# EAGLE design GasSensorModule_v2.2 (EAGLE 7.4.0)
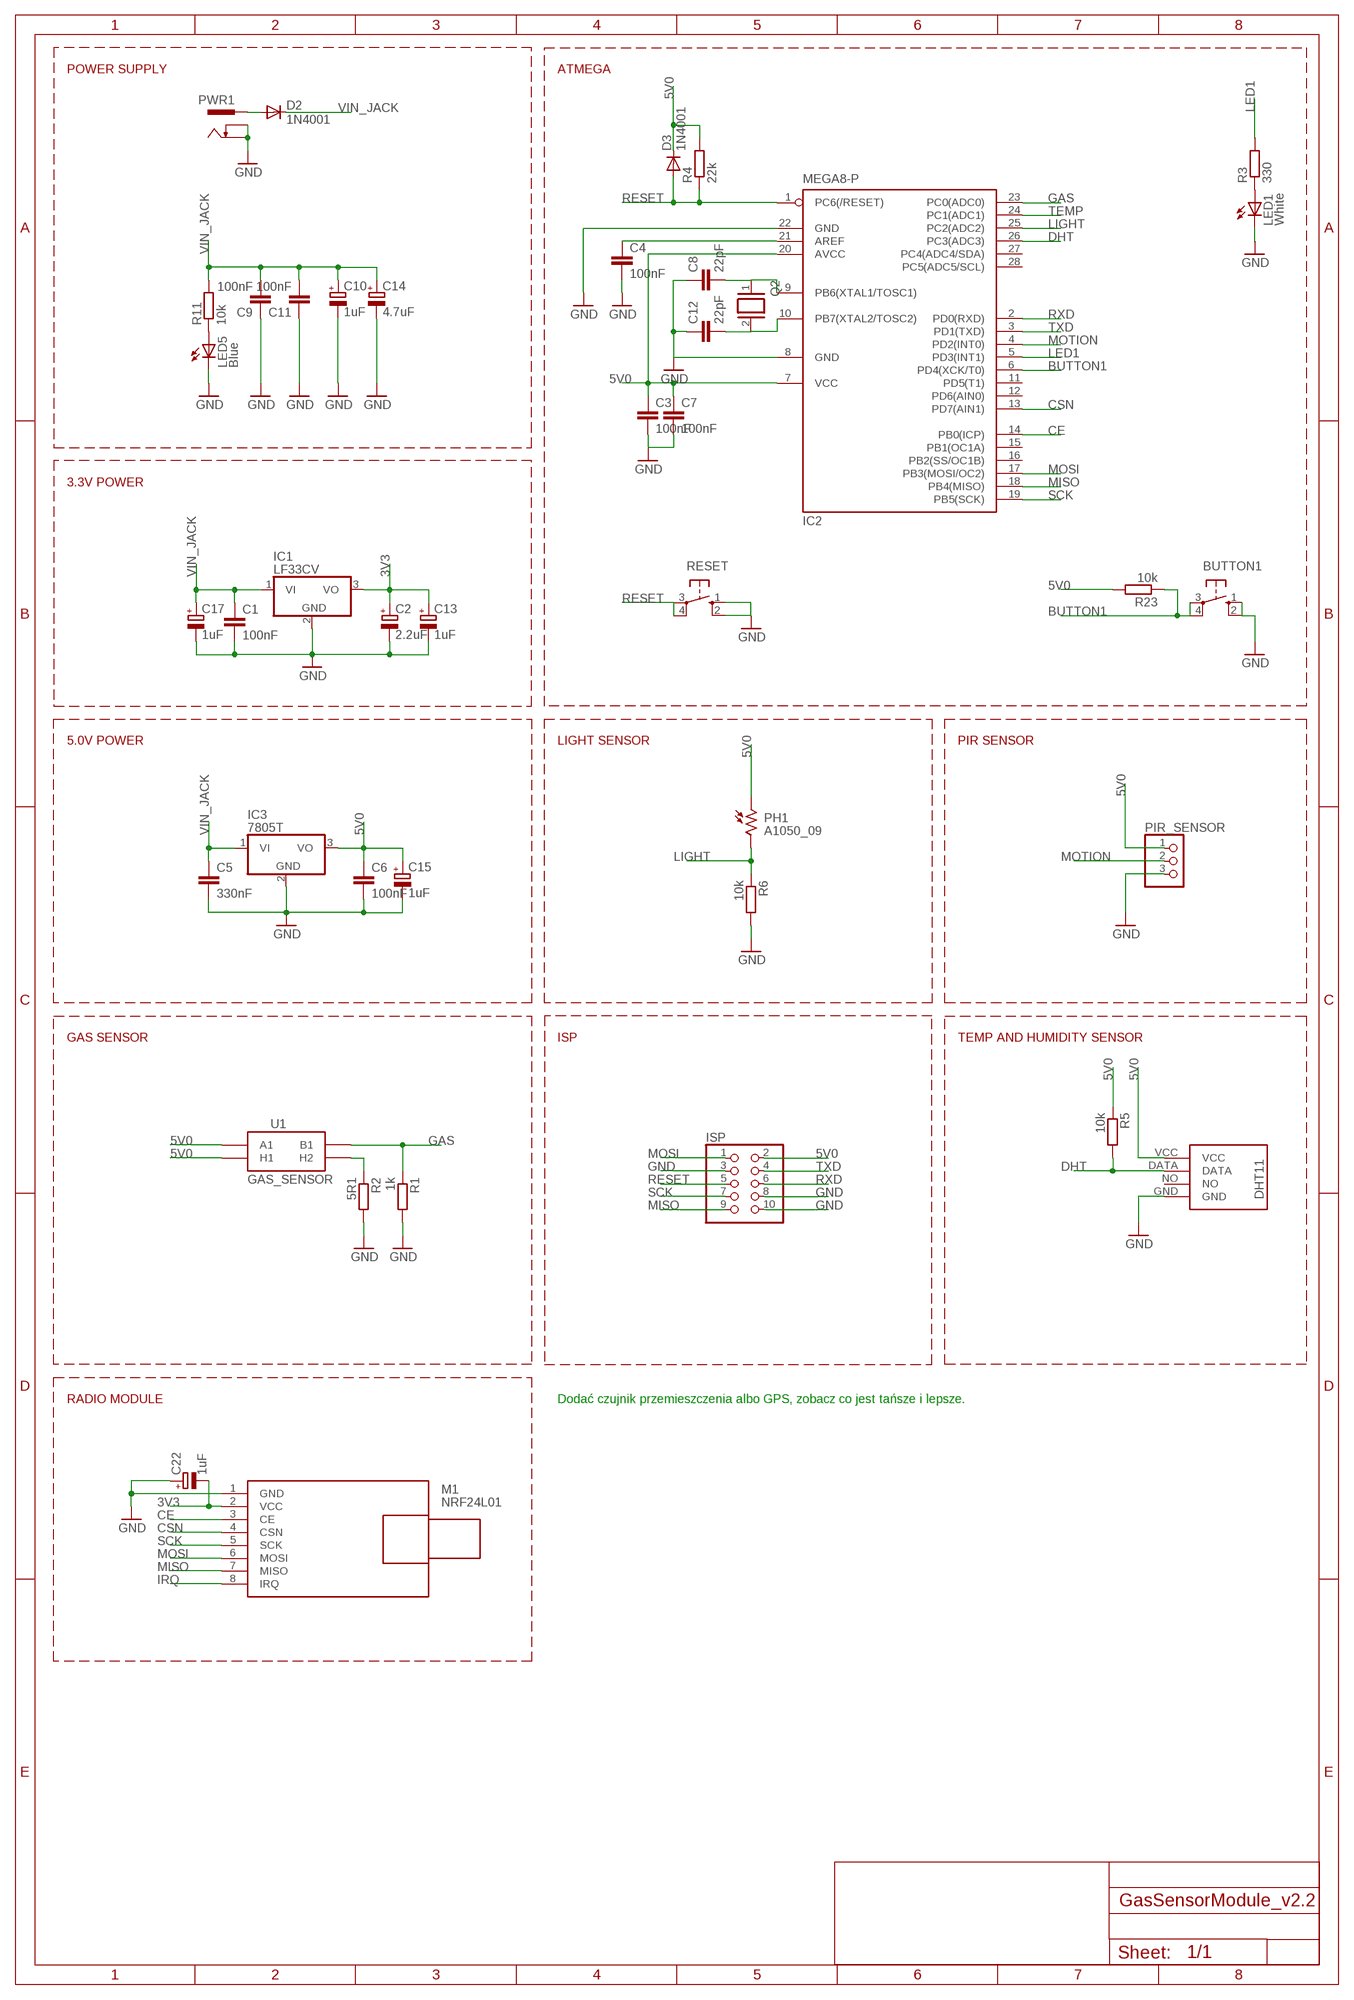
[diagram p0: schematic, sheet 1]

## Parts
BUTTON1  10-XX  [B3F-10XX]
C1  100nF  C-EU025-025X050  [C025-025X050]
C2  2.2uF  CPOL-EUE2.5-5  [E2,5-5]
C3  100nF  C-EU025-025X050  [C025-025X050]
C4  100nF  C-EU025-025X050  [C025-025X050]
C5  330nF  C-EU025-025X050  [C025-025X050]
C6  100nF  C-EU025-025X050  [C025-025X050]
C7  100nF  C-EU025-025X050  [C025-025X050]
C8  22pF  C-EU025-025X050  [C025-025X050]
C9  100nF  C-EU025-025X050  [C025-025X050]
C10  1uF  CPOL-EUE2.5-5  [E2,5-5]
C11  100nF  C-EU025-025X050  [C025-025X050]
C12  22pF  C-EU025-025X050  [C025-025X050]
C13  1uF  CPOL-EUE2.5-5  [E2,5-5]
C14  4.7uF  CPOL-EUE2.5-5  [E2,5-5]
C15  1uF  CPOL-EUE2.5-5  [E2,5-5]
C17  1uF  CPOL-EUE2.5-5  [E2,5-5]
C22  1uF  CPOL-EUE2.5-5  [E2,5-5]
D2  1N4001  1N4004  [DO41-10]
D3  1N4001  1N4004  [DO41-10]
IC1  LF33CV  7805T  [TO220H]
IC2  MEGA8-P  [DIL28-3]
IC3  7805T  [TO220H]
ISP  PINHD-2X5  [2X05]
LED1  White  LED3MM  [LED3MM]
LED5  Blue  LED3MM  [LED3MM]
M1  NRF24L01  WIRELESS-NRF24L01-PA-EXT  [WIRELESS-NRD24L01-PA-EXT]
PH1  A1050_09  [T0-46-A10XX]
PIR_SENSOR  PINHD-1X3  [1X03]
PWR1  PWR-JAKPWR_JACK_UNI_MILLING  [PWR_JACK_UNI_MILLING]
Q2  XTAL/S  [QS]
R1  1k  R-EU_0207/10  [0207/10]
R2  5R1  R-EU_0207/10  [0207/10]
R3  330  R-EU_0207/10  [0207/10]
R4  22k  R-EU_0207/10  [0207/10]
R5  10k  R-EU_0207/10  [0207/10]
R6  10k  R-EU_0207/10  [0207/10]
R11  10k  R-EU_0207/10  [0207/10]
R23  10k  R-EU_0207/10  [0207/10]
RESET  10-XX  [B3F-10XX]
U1  GAS_SENSOR  [MQ-3]
U$1  DHT11-PION.  [DHT11-PION.]

## Nets
3V3: C2.+ C13.+ C22.- IC1.3(VO) M1.2(VCC)
5V0: C3.1 C6.1 C7.1 C15.+ D3.C IC2.7(VCC) IC2.20(AVCC) IC3.3(VO) ISP.2 PH1.1 PIR_SENSOR.1 R4.2 R5.1 R23.2 U1.A1 U1.HA(H1) U$1.VCC
BUTTON1: BUTTON1.3(P) BUTTON1.4(P1) IC2.6(PD4(XCK/T0)) R23.1
CE: IC2.14(PB0(ICP)) M1.3(CE)
CSN: IC2.13(PD7(AIN1)) M1.4(CSN)
DHT: IC2.26(PC3(ADC3)) R5.2 U$1.DATA
GAS: IC2.23(PC0(ADC0)) R1.1 U1.B1
GND: BUTTON1.1(S) BUTTON1.2(S1) C1.2 C2.- C3.2 C4.2 C5.2 C6.2 C7.2 C8.1 C9.1 C10.- C11.1 C12.1 C13.- C14.- C15.- C17.- C22.+ IC1.2(GND) IC2.8(GND) IC2.22(GND) IC3.2(GND) ISP.3 ISP.8 ISP.10 LED1.K(C) LED5.K(C) M1.1(GND) PIR_SENSOR.3 PWR1.- PWR1.-- R1.2 R2.2 R6.2 RESET.1(S) RESET.2(S1) U$1.GND
IRQ: M1.8(IRQ)
LED1: IC2.5(PD3(INT1)) R3.2
LIGHT: IC2.25(PC2(ADC2)) PH1.2 R6.1
MISO: IC2.18(PB4(MISO)) ISP.9 M1.7(MISO)
MOSI: IC2.17(PB3(MOSI/OC2)) ISP.1 M1.6(MOSI)
MOTION: IC2.4(PD2(INT0)) PIR_SENSOR.2
N$1: C4.1 IC2.21(AREF)
N$3: R2.1 U1.HB(H2)
N$4: D2.A PWR1.+
N$5: LED1.A R3.1
N$10: LED5.A R11.1
N$29: C8.2 IC2.9(PB6(XTAL1/TOSC1)) Q2.1
N$35: C12.2 IC2.10(PB7(XTAL2/TOSC2)) Q2.2
RESET: D3.A IC2.1(PC6(/RESET)) ISP.5 R4.1 RESET.3(P) RESET.4(P1)
RXD: IC2.2(PD0(RXD)) ISP.6
SCK: IC2.19(PB5(SCK)) ISP.7 M1.5(SCK)
TEMP: IC2.24(PC1(ADC1))
TXD: IC2.3(PD1(TXD)) ISP.4
VIN_JACK: C1.1 C5.1 C9.2 C10.+ C11.2 C14.+ C17.+ D2.C IC1.1(VI) IC3.1(VI) R11.2
Unconnected: IC2.11(PD5(T1)) IC2.12(PD6(AIN0)) IC2.15(PB1(OC1A)) IC2.16(PB2(SS/OC1B)) IC2.27(PC4(ADC4/SDA)) IC2.28(PC5(ADC5/SCL)) U$1.NO

## Notes on the sheet
- POWER SUPPLY | ATMEGA
- 3.3V POWER
- 5.0V POWER | LIGHT SENSOR | PIR SENSOR
- GAS SENSOR | ISP | TEMP AND HUMIDITY SENSOR
- RADIO MODULE | Dodać czujnik przemieszczenia albo GPS, zobacz co jest tańsze i lepsze.

## Library data of the parts
BUTTON1 RESET = switch-omron:10-XX: OMRON SWITCH; MPN: B3F-1000; OC_FARNELL: 176432; OC_NEWARK: 36M3542
C1 C3-C9 C11 C12 = rcl:C-EU: CAPACITOR, European symbol
C2 C10 C13-C15 C17 C22 = rcl:CPOL-EU: POLARIZED CAPACITOR, European symbol
D2 D3 = diode:1N4004: DIODE general purpose rectifier, 1 A
IC1 IC3 = linear:78*: Positive VOLTAGE REGULATOR Source: http://cache.national.com/ds/LM/LM78L05.pdf http://www.fairchildsemi.com/ds/LM/LM7805.pdf
IC2 = atmel:MEGA8-P: MICROCONTROLLER 8 Kbytes FLASH, 1 kbytes SRAM, 512 bytes EEPROM, USART, 4-channel 10 bit ADC, 2-channel 8 bit ADC Pin compatible with Atmega48, ATMega88, ATMega168 Source: avr.lbr; OC_FARNELL: unknown; OC_NEWARK: unknown
ISP = pinhead:PINHD-2X5: PIN HEADER
LED1 LED5 = led:LED: LED OSRAM: - CHIPLED LG R971, LG N971, LY N971, LG Q971, LY Q971, LO R971, LY R971 LH N974, LH R974 LS Q976, LO Q976, LY Q976 LO Q996 - Hyper CHIPLED LW Q18S LB Q993, LB Q99A, LB R99A - SideLED LS A670, LO A670, LY A670, LG A670, LP A670 LB A673, LV A673, LT A673, LW A673 LH A674 LY A675 LS A676, LA A676, LO A676, LY A676, LW A676 LS A679, LY A679, LG A679 - Hyper Micro SIDELED® LS Y876, LA Y876, LO Y876, LY Y876 LT Y87S - SmartLED LW L88C, LW L88S LB L89C, LB L89S, LG L890 LS L89K, LO L89K, LY L89K LS L896, LA L896, LO L896, LY L896 - TOPLED LS T670, LO T670, LY T670, LG T670, LP T670 LSG T670, LSP T670, LSY T670, LOP T670, LYG T670 LG T671, LOG T671, LSG T671 LB T673, LV T673, LT T673, LW T673 LH T674 LS T676, LA T676, LO T676, LY T676, LB T676, LH T676, LSB T676, LW T676 LB T67C, LV T67C, LT T67C, LS T67K, LO T67K, LY T67K, LW E67C LS E67B, LA E67B, LO E67B, LY E67B, LB E67C, LV E67C, LT E67C LW T67C LS T679, LY T679, LG T679 LS T770, LO T770, LY T770, LG T770, LP T770 LB T773, LV T773, LT T773, LW T773 LH T774 LS E675, LA E675, LY E675, LS T675 LS T776, LA T776, LO T776, LY T776, LB T776 LHGB T686 LT T68C, LB T68C - Hyper Mini TOPLED® LB M676 - Mini TOPLED Santana® LG M470 LS M47K, LO M47K, LY M47K Source: http://www.osram.convergy.de LUXEON: - LUMILED® LXK2-PW12-R00, LXK2-PW12-S00, LXK2-PW14-U00, LXK2-PW14-V00 LXK2-PM12-R00, LXK2-PM12-S00, LXK2-PM14-U00 LXK2-PE12-Q00, LXK2-PE12-R00, LXK2-PE12-S00, LXK2-PE14-T00, LXK2-PE14-U00 LXK2-PB12-K00, LXK2-PB12-L00, LXK2-PB12-M00, LXK2-PB14-N00, LXK2-PB14-P00, LXK2-PB14-Q00 LXK2-PR12-L00, LXK2-PR12-M00, LXK2-PR14-Q00, LXK2-PR14-R00 LXK2-PD12-Q00, LXK2-PD12-R00, LXK2-PD12-S00 LXK2-PH12-R00, LXK2-PH12-S00 LXK2-PL12-P00, LXK2-PL12-Q00, LXK2-PL12-R00 Source: www.luxeon.com KINGBRIGHT: KA-3528ASYC Source: www.kingbright.com
M1 = diy-modules:WIRELESS-NRF24L01-PA-EXT: 2.4 GHz Wireless Module based on NRF24L01 chip with preamplifier and external antenna
PH1 = photo-elements:A10: Sensor Robust Light Sensing Applications Outdoor Light Sensing Application Source: http://optoelectronics.perkinelmer.com/content/Datasheets/DTS_PhotocellsA1050.pdf
PIR_SENSOR = pinhead:PINHD-1X3: PIN HEADER
PWR1 = iMX233-OLINUXINO-MAXI_Rev_D:PWR-JAK
Q2 = special:XTAL/S: CRYSTAL
R1-R6 R11 R23 = rcl:R-EU_: RESISTOR, European symbol
U1 = SparkFun-Sensors:GAS_SENSOR: MQ-3 alcohol gas sensor . FP not tested. SEN-08880.
U$1 = DHT11:DHT11-PION.: DHT11 Czujnik temperatury i wilgotności (widok pionowy)

## Board
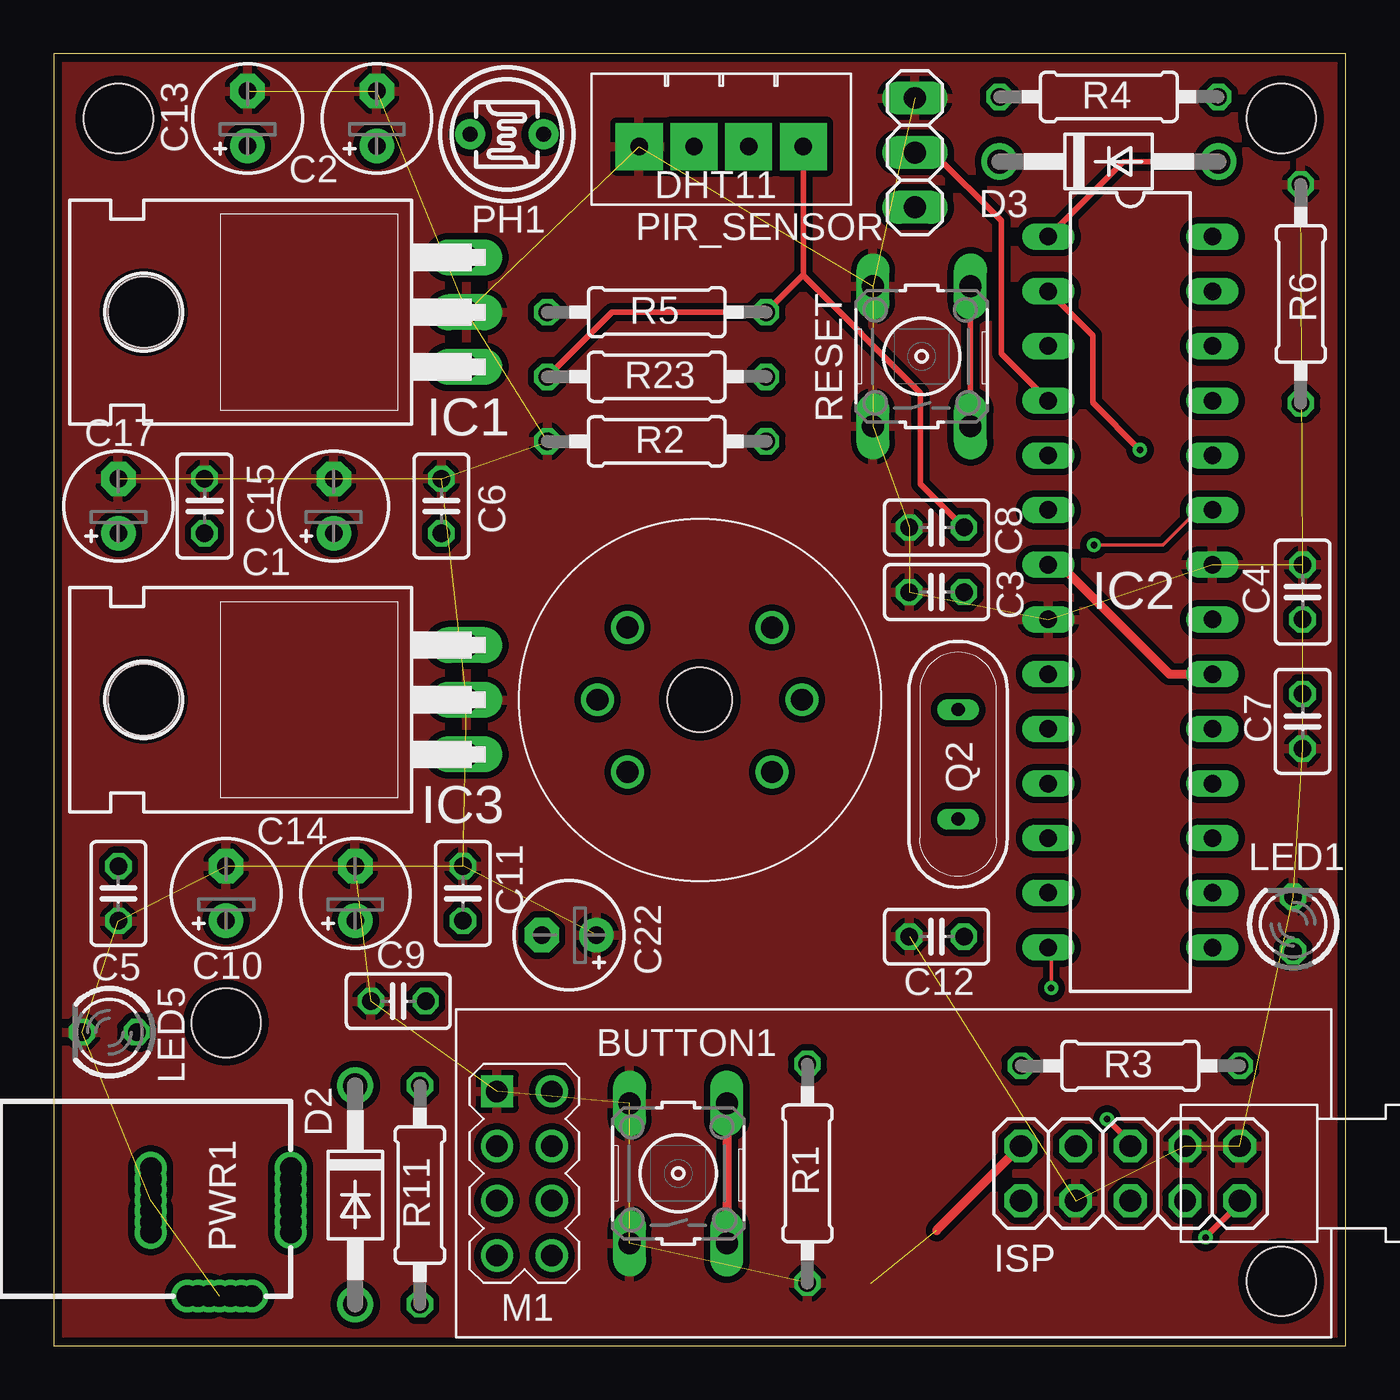
[diagram p1: board, top side]
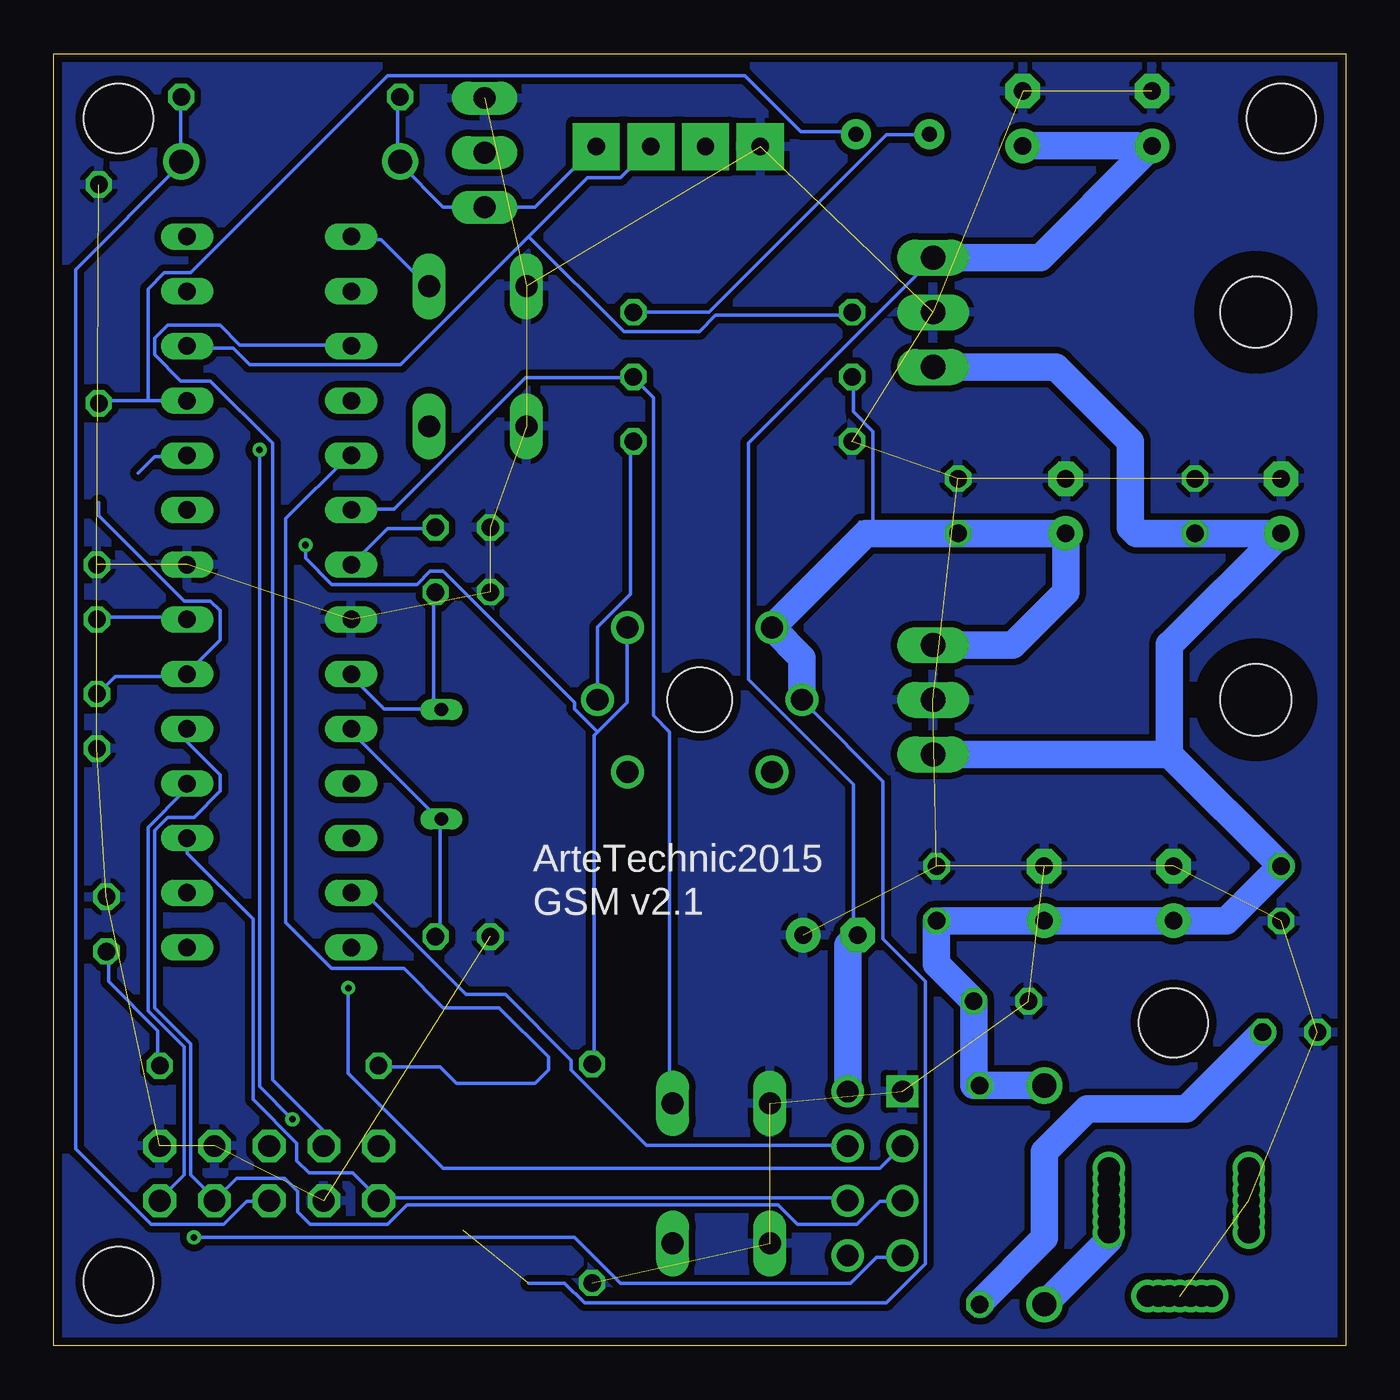
[diagram p2: board, bottom side, seen from below]

Size 60 x 60 mm. Coordinates in mm from the lower left corner, seen from the top.
Outline: 0,0 60,0 60,60 0,60 0,0
Copper layers (1*16): Top 0.0356mm / dielectric 1.5011mm / Bottom 0.0356mm
Design rules "oshpark-2layer *": minimum track width 6mil, minimum drill 13mil, track to track 6mil, track to pad 6mil, pad to pad 6mil, via to via 6mil, smd to smd 6mil, copper to edge 15mil, drill to drill 6mil, minimum pad ring 7mil, minimum via ring 7mil, stop-mask expansion 4mil, vias tented up to drill 12mil, thermal gap 10mil
Holes 3.2 mm at 3,57 8,15 57,3 57,57

### Footprints (pad centres in the part's own frame; a part is rotated, then mirrored left to right if it is on the bottom)
B3F-10XX = drill 1.016 long: 1 -3.251,2.261; 2 3.251,2.261; 3 -3.251,-2.261; 4 3.251,-2.261
C025-025X050 = drill 0.813 octagon: 1 -1.27,0; 2 1.27,0
E2,5-5 = drill 0.813 pad 1.6: + -1.27,0 | drill 0.813 pad 1.6 octagon: - 1.27,0
DO41-10 = drill 1.118: A 5.08,0; C -5.08,0
TO220H = drill 1.118 long: 1 -2.54,-10.16; 2 0,-10.16; 3 2.54,-10.16 | hole 3.302: 0,4.826
DIL28-3 = drill 0.813 long: 1 -16.51,-3.81; 2 -13.97,-3.81; 3 -11.43,-3.81; 4 -8.89,-3.81; 5 -6.35,-3.81; 6 -3.81,-3.81; 7 -1.27,-3.81; 8 1.27,-3.81; 9 3.81,-3.81; 10 6.35,-3.81; 11 8.89,-3.81; 12 11.43,-3.81; 13 13.97,-3.81; 14 16.51,-3.81; 15 16.51,3.81; 16 13.97,3.81; 17 11.43,3.81; 18 8.89,3.81; 19 6.35,3.81; 20 3.81,3.81; 21 1.27,3.81; 22 -1.27,3.81; 23 -3.81,3.81; 24 -6.35,3.81; 25 -8.89,3.81; 26 -11.43,3.81; 27 -13.97,3.81; 28 -16.51,3.81
2X05 = drill 1.016 octagon: 1 -5.08,-1.27; 2 -5.08,1.27; 3 -2.54,-1.27; 4 -2.54,1.27; 5 0,-1.27; 6 0,1.27; 7 2.54,-1.27; 8 2.54,1.27; 9 5.08,-1.27; 10 5.08,1.27
LED3MM = drill 0.813 octagon: A -1.27,0; K 1.27,0
WIRELESS-NRD24L01-PA-EXT = drill 1 square: 1 -18.415,3.81 | drill 1: 2 -15.875,3.81; 3 -18.415,1.27; 4 -15.875,1.27; 5 -18.415,-1.27; 6 -15.875,-1.27; 7 -18.415,-3.81; 8 -15.875,-3.81
T0-46-A10XX = drill 0.7 pad 1.4: 1 -1.7,0; 2 1.7,0
1X03 = drill 1.016 long: 1 -2.54,0; 2 0,0; 3 2.54,0
PWR_JACK_UNI_MILLING = drill 1: + 0,4.75; +1 0,5.25; +2 0,5.75; +3 0,6.25; +4 0,4.25; +5 0,3.75; +6 0,3.25; - -6.5,4.75; -1 -6.5,5.25; -2 -6.5,5.75; -3 -6.5,4.25; -4 -6.5,3.75; -5 -6.5,6.25; -6 -6.5,3.25; -- -3.3,0.3; --1 -3.8,0.3; --2 -4.3,0.3; --3 -4.8,0.3; --4 -2.8,0.3; --5 -2.3,0.3; --6 -1.8,0.3
QS = drill 0.61 long: 1 -2.54,0; 2 2.54,0
0207/10 = drill 0.813 octagon: 1 -5.08,0; 2 5.08,0
MQ-3 = drill 1.016: A1 -3.35,3.35; A2 -3.35,-3.35; B1 3.35,3.35; B2 3.35,-3.35; HA -4.75,0; HB 4.75,0 | hole 3: 0,0
DHT11-PION. = drill 0.8 pad 2.184 square: DATA -1.27,0.305; GND 3.81,0.305; NO 1.27,0.305; VCC -3.81,0.305

### Placement (x,y rotation side)
BUTTON1  29,8 90 top
C1  7,39 90 top
C2  15,57 90 top
C3  41,38 180 top
C4  58,35 90 top
C5  3,21 270 top
C6  18,39 90 top
C7  58,29 270 top
C8  41,35 0 top
C9  16,16 0 top
C10  8,21 90 top
C11  19,21 270 top
C12  41,19 0 top
C13  9,57 90 top
C14  14,21 90 top
C15  13,39 90 top
C17  3,39 90 top
C22  23.93,19.07 180 top
D2  14,7 270 top
D3  49,55 0 top
IC1  9,48 90 top
IC2  50,35 270 top
IC3  9,30 90 top
ISP  50,8 0 top
LED1  57.56,19.58 90 top
LED5  2.58,14.56 180 top
M1  39,8 0 top
PH1  21.04,56.26 0 top
PIR_SENSOR  39.99,55.41 90 top
PWR1  11,2 0 top
Q2  42,27 270 top
R1  35,8 270 top
R2  28,42 180 top
R3  50,13 180 top
R4  49,58 180 top
R5  28,48 180 top
R6  57.91,48.85 90 top
R11  17,7 90 top
R23  28,45 180 top
RESET  40.31,45.95 90 top
U1  30,30 0 top
U$1  31,56 180 top

### Tracks (layer width: path | path; a pad name or v marks a point on that pad's centre or on a via)
3V3
  Bottom 0.152: C22.- 22.86,19.66 22.86,26.06 27.74,30.94 27.74,41.91 19.51,50.14 IC1.3
  Bottom 1.27: IC1.3 14.19,50.54 9.37,55.37 | 9.37,55.37 C13.+ | C2.+ 9.73,55.73 9.37,55.37 | M1.2 23.12,18.61 C22.-
5V0  (1 unrouted)
  Top 0.254: R23.2 25.92,48 R5.1 34.77,49.69 34.81,49.69 | 34.81,49.69 U$1.VCC | C3.1 40.25,40.02 40.25,44.25 34.81,49.69
  Top 0.406: 41,5.35 ISP.2 | IC2.7 46.73,36.27 51.81,31.19 IC2.20
  Bottom 0.152: 22.55,38.25 22.27,37.73 | C3.1 42.37,37.95 44.5,37.95 46.18,36.27 IC2.7 | C7.1 57.91,30.33 57.15,31.09 53.95,31.09 IC2.20 53.8,31.24 52.27,32.77 52.27,34.14 52.73,34.59 53.95,34.59 57.91,38.56 57.91,39.17 | R4.2 44.04,57.91 44.04,55.02 D3.C 43.89,54.86 41.91,52.88 40.08,52.88 PIR_SENSOR.1 39.93,52.88 37.64,52.88 34.9,55.63 U$1.VCC | 21.95,37.73 21.95,42.47 22.86,43.38 22.86,44.96 R23.2 | PH1.1 19.36,56.24 21.34,56.24 29.57,48 R5.1 | 37.95,2.9 36.27,2.9 35.36,1.98 21.34,1.98 19.51,3.81 19.51,16.92 21.49,18.9 21.49,26.21 24.84,29.57 U1.HA
  Bottom 1.27: IC3.3 15.46,32.54 13,35 C15.+ C6.1 21.95,37.73 22.27,37.73 U1.A1 25.25,31.95 U1.HA
BUTTON1
  Top 0.406: BUTTON1.4 BUTTON1.3
  Bottom 0.152: IC2.6 46.18,38.86 44.2,38.86 38.1,44.96 33.22,44.96 R23.1 33.07,44.96 32.16,44.04 32.16,29.26 31.39,28.5 31.39,11.28 BUTTON1.4
CE  (via drill 0.3)
  Top 0.152: v46.33,16.61 46.33,18.44 IC2.14
  Bottom 0.152: v46.33,16.61 46.33,12.65 41.91,8.23 21.64,8.23 20.73,9.14 M1.3
CSN
  Bottom 0.152: IC2.13 46.18,20.88 45.41,20.88 40.84,16.31 39.01,16.31 35.97,13.26 35.97,12.8 32.46,9.3 23.16,9.3 M1.4
DHT
  Bottom 0.152: 37.95,51.51 35.2,54.25 33.68,54.25 32.31,55.63 U$1.DATA | 37.95,51.51 43.89,45.57 50.9,45.57 51.66,46.33 53.8,46.33 IC2.26 | 37.95,51.51 33.53,47.09 30.02,47.09 29.26,47.85 23.01,47.85 R5.2
GAS  (via drill 0.3)
  Top 0.152: v48.31,37.19 51.51,37.19 53.03,38.71 53.8,38.71 IC2.23
  Bottom 0.152: 34.75,28.5 33.38,29.87 33.38,33.22 U1.B1 | 34.75,28.5 34.9,28.35 34.9,13.11 R1.1 | v48.31,37.19 48.31,36.58 47.09,35.36 43.13,35.36 42.52,35.97 41.91,35.97 35.81,29.87 35.81,29.57 34.75,28.5
GND  (37 unrouted)
  pour Bottom (isolate 0.305): 0,60 60,60 60,0 0,0
  pour Top (isolate 0.305): 0,60 60,60 60,0 0,0
LED1
  Bottom 0.152: R3.2 44.81,12.95 42.06,12.95 41.3,12.19 37.64,12.19 37.03,12.8 37.03,13.41 39.32,15.7 41.91,15.7 43.74,17.53 47.09,17.53 49.23,19.66 49.23,38.41 46.33,41.3 IC2.5
LIGHT
  Bottom 0.152: 55.63,43.89 57.76,43.89 R6.1 | 55.63,43.89 53.95,43.89 IC2.25 | 55.63,43.89 55.63,49.07 54.86,49.84 53.65,49.84 44.5,58.98 27.89,58.98 25.3,56.39 22.86,56.39 PH1.2
MISO  (via drill 0.3)
  Top 0.254: v53.49,5.03 55.08,6.62 ISP.9
  Bottom 0.152: IC2.18 53.95,26.06 53.95,25.76 55.63,24.08 55.63,15.54 53.95,13.87 53.95,7.92 55.02,6.86 ISP.9 | v53.49,5.03 35.81,5.03 33.68,2.9 23.01,2.9 21.79,4.12 20.73,4.12 M1.7
MOSI
  Bottom 0.152: IC2.17 53.8,23.47 53.8,22.86 50.75,19.81 50.75,11.43 48.71,9.39 48.71,8.59 48.15,8.02 46.12,8.02 44.96,6.86 ISP.1 44.81,6.86 23.16,6.86 M1.6
MOTION
  Top 0.254: PIR_SENSOR.2 40.84,55.41 44,52.25 44,46.08 IC2.4
N$1
  Bottom 0.152: IC2.21 53.95,33.83 57.91,33.83 C4.1
N$3
  Bottom 0.152: R2.1 33.22,41.91 33.22,34.9 34.75,33.38 34.75,30.02 U1.HB
N$4
  Bottom 1.27: PWR1.+ 11,4.92 D2.A
N$5
  Bottom 0.152: R3.1 55.17,13.11 55.17,14.63 57.45,16.92 57.45,18.29 LED1.A
N$10
  Bottom 1.27: R11.1 17,2 14,5 14,9 12,11 7.41,11 LED5.A
N$29
  Bottom 0.152: 42.37,29.57 44.65,29.57 46.18,31.09 IC2.9 | 42.37,29.57 42.06,29.57 Q2.1 42.37,29.57 | 42.37,29.57 42.37,34.9 C8.2
N$35
  Bottom 0.152: 42.06,24.38 42.06,19.2 42.22,19.05 C12.2 | 42.06,24.38 46.18,28.5 IC2.10 | 42.06,24.38 Q2.2
RESET
  Top 0.254: RESET.4 RESET.3 | IC2.1 49.68,55 D3.A
  Bottom 0.152: IC2.1 46.18,51.36 44.81,51.36 42.67,49.23 RESET.4 | R4.1 54.1,57.91 54.1,55.02 D3.A 54.1,54.86 58.98,49.99 58.98,9.14 55.47,5.64 52.12,5.64 51.05,6.71 50.14,6.71 ISP.5
RXD  (via drill 0.3)
  Top 0.254: IC2.2 48.25,46.91 48.25,43.8 v50.44,41.6 | v48.92,10.52 50,9.44 ISP.6
  Bottom 0.152: v50.44,41.6 50.44,12.04 v48.92,10.52
SCK
  Bottom 0.152: IC2.19 53.8,28.5 53.8,28.04 52.27,26.52 52.27,25.76 53.49,24.54 54.71,24.54 55.32,23.93 55.32,15.7 53.65,14.02 53.65,7.92 52.58,6.86 ISP.7 52.43,6.86 51.51,7.77 49.28,7.77 48.67,7.16 48.67,6.21 48.1,5.64 44.5,5.64 43.59,6.55 26.36,6.55 25.45,5.64 22.71,5.64 21.64,6.71 20.73,6.71 M1.5
TEMP
  Bottom 0.152: 56.08,40.54 55.32,41.3 53.95,41.3 IC2.24
TXD
  Bottom 0.152: IC2.3 46.33,46.48 51.36,46.48 52.27,47.4 54.71,47.4 55.32,46.79 55.32,46.02 54.1,44.81 52.73,44.81 49.84,41.91 49.84,12.34 47.55,10.06 47.55,9.3 ISP.4
VIN_JACK
  Bottom 1.27: D2.C R11.2 17.27,12.08 C9.2 19,17.73 C11.2 C14.+ C10.+ 5.54,19.73 C5.1 8.19,27.46 | IC3.1 8.19,27.46 | 8.19,27.46 8.19,32.57 8.16,32.57 C17.+ C1.1 9.73,37.73 10,38 10,42 13.46,45.46 IC1.1

### Text on the board
bPlace: ArteTechnic2015 | GSM v2.1